# Altium schematic sheet 噪声监测器.SchDoc
size A3; SheetNumber: 0; SheetTotal: 0
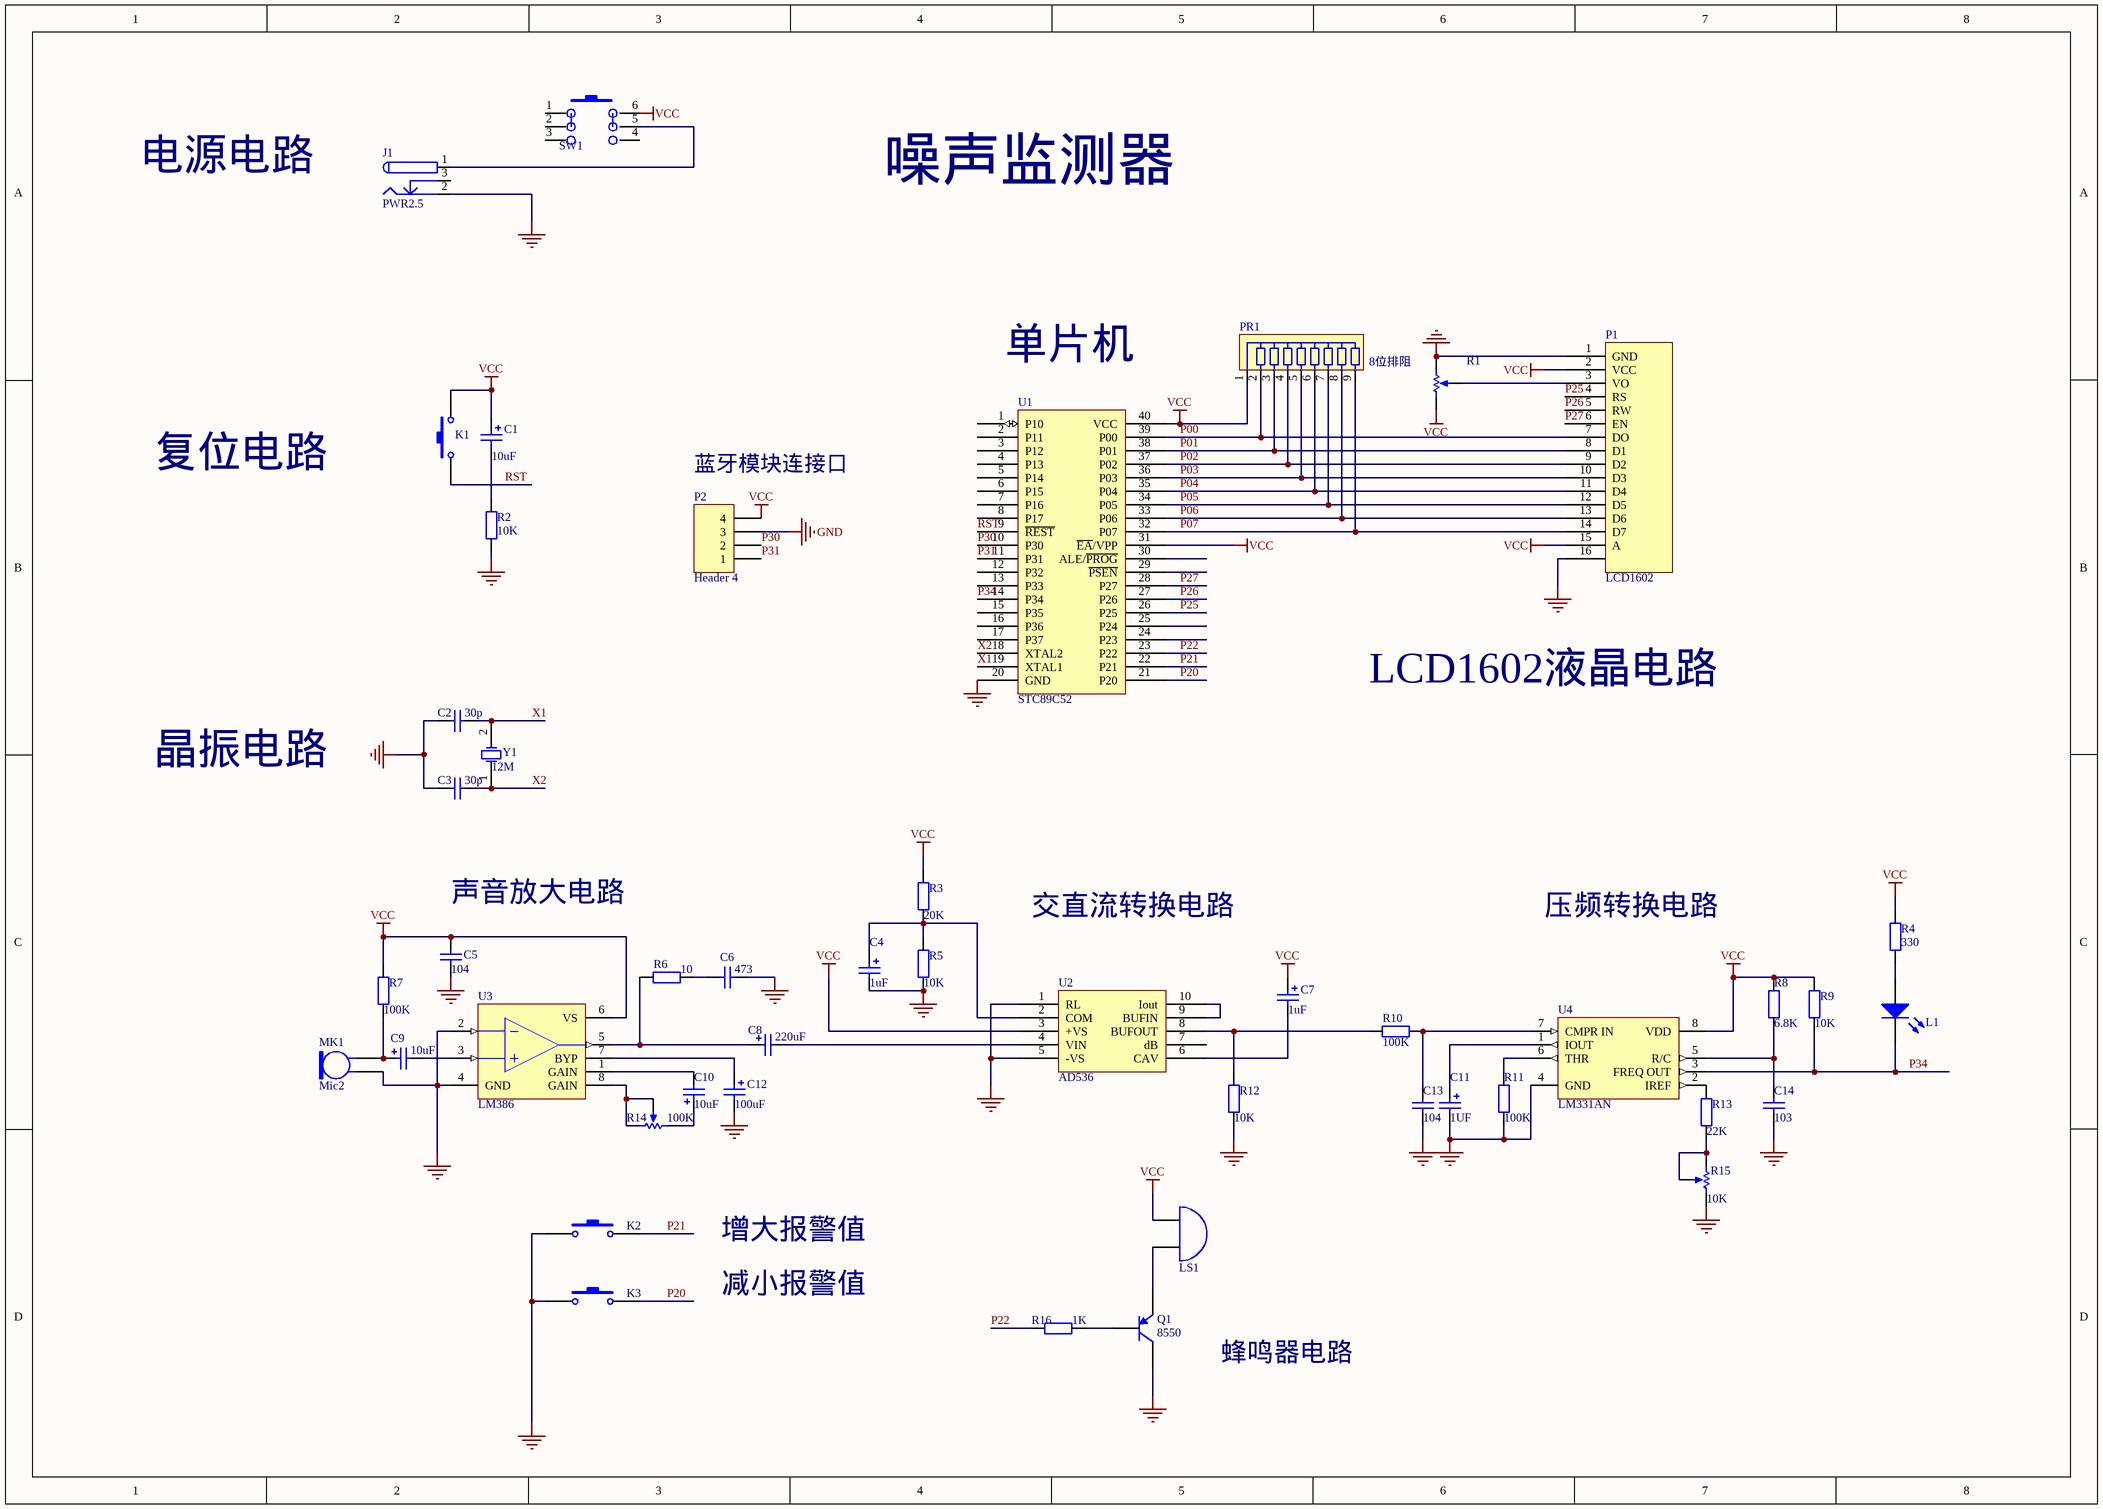
[diagram p0: 噪声监测器.SchDoc]

## Parts
C1  10uF  [CAP2]
C2  30p  [CAPNORM]
C3  30p  [CAPNORM]
C4  1uF  [CAP3]
C5  104  [CAPNORM]
C6  473  [CAPNORM]
C7  1uF  [CAP3]
C8  220uF  [CAP4]
C9  10uF  [CAP2]
C10  10uF  [CAP2]
C11  1UF  [CAP2]
C12  100uF  [CAP3]
C13  104  [CAPNORM]
C14  103  [CAPNORM]
J1  PWR2.5  [PWR5V]
K1  SW-AJ  [KaiGuan]  (value not drawn)
K2  SW-AJ  [KaiGuan]  (value not drawn)
K3  SW-AJ  [KaiGuan]  (value not drawn)
L1  LED  [LED]  (value not drawn)
LS1  Bell  [FengMing]  (value not drawn)
MK1  Mic2  [MK1]
P1  LCD1602  [1602]
P2  Header 4  [HT396K-4]
PR1  8位排阻  [HDR1X9]
Q1  8550  [SANJIGUAN]
R1  (no value)  [DIANWEIQI]
R2  10K  [AXIAL-0.3]
R3  20K  [AXIAL-0.3]
R4  330  [AXIAL-0.3]
R5  10K  [AXIAL-0.3]
R6  10  [AXIAL-0.3]
R7  100K  [AXIAL-0.3]
R8  6.8K  [AXIAL-0.3]
R9  10K  [AXIAL-0.3]
R10  100K  [AXIAL-0.3]
R11  100K  [AXIAL-0.3]
R12  10K  [AXIAL-0.3]
R13  22K  [AXIAL-0.3]
R14  100K  [Bianzuqi]
R15  10K  [Bianzuqi]
R16  1K  [AXIAL-0.3]
SW1  SW-6P  [SW-6P]  (value not drawn)
U1  STC89C52  [52DANPIANJi]
U2  AD536  [AD536]
U3  LM386  [LM386]
U4  LM331AN  [LM331AN]
Y1  12M  [JINGZHEN]

## Nets
GND: C2.1 C3.1 C4.2 C5.1 C6.1 C11.2 C12.2 C13.1 C14.1 J1.2 K2.1 K3.1 MK1.2 P1.1(GND) P1.16(K) P2.3 Q1.3(C) R1.3(TAP) R2.1 R5.2 R11.1 R12.2 R15.3(TAP) U1.20(GND) U2.1(RL) U2.5(-VS) U3.2(IN-) U3.4(GND) U4.4(GND)
VCC: C1.1 C5.2 C7.1 K1.2 LS1.1(A) P1.2(VCC) P1.15(A) P2.4 PR1.1 R1.1(TOP) R3.1 R4.1 R7.2 R8.1 R9.2 SW1.6 U1.31(~{EA}/VPP) U1.40(VCC) U2.3(+VS) U3.6(VS) U4.8(VDD)
P00: P1.7(DO) PR1.2 U1.39(P00)
P01: P1.8(D1) PR1.3 U1.38(P01)
P02: P1.9(D2) PR1.4 U1.37(P02)
P03: P1.10(D3) PR1.5 U1.36(P03)
P04: P1.11(D4) PR1.6 U1.35(P04)
P05: P1.12(D5) PR1.7 U1.34(P05)
P06: P1.13(D6) PR1.8 U1.33(P06)
P07: P1.14(D7) PR1.9 U1.32(P07)
P20: K3.2 U1.21(P20)
P21: K2.2 U1.22(P21)
P22: R16.1 U1.23(P22)
P25: P1.4(RS) U1.26(P25)
P26: P1.5(RW) U1.27(P26)
P27: P1.6(EN) U1.28(P27)
P30: P2.2 U1.10(P30)
P31: P2.1 U1.11(P31)
P34: L1.2(K) R9.1 U1.14(P34) U4.3(FREQ_OUT)
RST: K1.1 U1.9(~{REST})
X1: C2.2 U1.19(XTAL1) Y1.2(OSC2)
X2: C3.2 U1.18(XTAL2) Y1.1(OSC1)
NetC1_2: C1.2 R2.2
NetC4_1: C4.1 R3.2 R5.1 U2.2(COM)
NetC6_2: C6.2 R6.1
NetC7_2: C7.2 U2.6(CAV)
NetC8_1: C8.1 R6.2 U3.5(OUT)
NetC8_2: C8.2 U2.4(VIN)
NetC9_1: C9.1 MK1.1 R7.1
NetC9_2: C9.2 U3.3(IN+)
NetC10_1: C10.1 R14.1(TOP)
NetC10_2: C10.2 U3.1(GAIN)
NetC11_1: C11.1 U4.1(IOUT)
NetC12_1: C12.1 U3.7(BYP)
NetC13_2: C13.2 R10.2 U4.7(CMPR_IN)
NetC14_2: C14.2 R8.2 U4.5(R/C)
NetJ1_1: J1.1 SW1.5
NetL1_1: L1.1(A) R4.2
NetLS1_2: LS1.2(B) Q1.1(E)
NetP1_3: P1.3(VO) R1.2(BOT)
NetQ1_2: Q1.2(B) R16.2
NetR10_1: R10.1 R12.1 U2.8(BUFOUT)
NetR11_2: R11.2 U4.6(THR)
NetR13_1: R13.1 U4.2(IREF)
NetR13_2: R13.2 R15.1(TOP) R15.2(BOT)
NetR14_2: R14.2(BOT) R14.3(TAP) U3.8(GAIN)
NetU2_9: U2.9(BUFIN) U2.10(Iout)

Not connected (* = marked no-connect by the designer): J1 3; SW1 1 2 3 4; U1 1(P10) 2(P11) 3(P12) 4(P13) 5(P14) 6(P15) 7(P16) 8(P17) 12(P32) 13(P33) 15(P35) 16(P36) 17(P37) 24(P23) 25(P24) 29(~{PSEN}) 30(ALE/~{PROG}); U2 7(dB)

## Notes on the sheet
- 电源电路
- 噪声监测器
- 单片机
- 复位电路
- (near P2) 蓝牙模块连接口
- LCD1602液晶电路
- 晶振电路
- (near C5) 声音放大电路
- 交直流转换电路
- 压频转换电路
- 增大报警值
- 减小报警值
- 蜂鸣器电路

## Library data of the parts
C1 C4 C7-C12 = C+
C2 C3 = CAP: Value: 33p
C5 C6 C13 C14 = CAP
J1 = PWR2.5: Low Voltage Power Supply Connector; Published: 17-Dec-2003; DatasheetDocument: 09-May-2002; Publisher: Altium Limited; ComponentLink1Description: Manufacturer Link; ComponentLink1URL: http://domino.kycon.com/internet/Products.html
LS1 = Bell: Electrical Bell; Manufacturer: Generic Components; Published: 1999
MK1 = Mic2: Microphone; Published: 24-Mar-1999; LatestRevisionDate: 17-Jul-2002; LatestRevisionNote: Re-released for DXP Platform.; PackageReference: PIN2; Publisher: Altium Limited
P2 = Header 4: Header, 4-Pin; LatestRevisionDate: 17-Jul-2002; LatestRevisionNote: Re-released for DXP Platform.; Publisher: Altium Limited
Q1 = 2N3906: PNP General Purpose Amplifier; Published: 8-Jun-2000; LatestRevisionDate: 15-Jan-2003; LatestRevisionNote: PCB Footprint 'BCY-W3/D4.7' replaced; DatasheetVersion: 1997; PackageVersion: Sep-1998; PackageReference: TO-92A; Publisher: Altium Limited; PackageDescription: TO, Flat Index; 3 In-Line, Axial Leads; Body Dia. 4.5mm; Leads 0.51 x 0.48 mm (max); ComponentLink1Description: Manufacturer Link; ComponentLink1URL: http://www.fairchildsemi.com/; ComponentLink2Description: Datasheet; ComponentLink2URL: http://www.fairchildsemi.com/ds/2N%2F2N3906.pdf
R1 = RPot: Potentiometer; Sim Note: Enter the Resistance value and the set point into parameter fields.; Set Position: 0.5; Value: 10K; Published: 8-Jun-2000; LatestRevisionDate: 17-Jul-2002; LatestRevisionNote: Re-released for DXP Platform.; PackageReference: VR5; Publisher: Altium Limited; PackageDescription: Variable Resistor, Thru-Hole; 3 Leads
R2 R16 = Res2: Resistor; Published: 8-Jun-2000; LatestRevisionDate: 17-Jul-2002; LatestRevisionNote: Re-released for DXP Platform.; PackageReference: AXIAL-0.4; Publisher: Altium Limited
  R2: Value: 10K
  R16: Value: 1K
R3 R5-R7 R12 = RES0.4
R4 = Res2: Resistor; Value: 1K; Published: 8-Jun-2000; LatestRevisionDate: 17-Jul-2002; LatestRevisionNote: Re-released for DXP Platform.; PackageReference: AXIAL-0.4; Publisher: Altium Limited
R8-R11 R13 = 电阻
R14 R15 = RPot: Potentiometer; Sim Note: Enter the Resistance value and the set point into parameter fields.; Set Position: 0.5; Published: 8-Jun-2000; LatestRevisionDate: 17-Jul-2002; LatestRevisionNote: Re-released for DXP Platform.; PackageReference: VR5; Publisher: Altium Limited; PackageDescription: Variable Resistor, Thru-Hole; 3 Leads
  R14: Value: 100K
  R15: Value: 10K
U1 = AT89S52_1
U2 = AD536A
U3 = LM386M-1: Low-Voltage Audio Power Amplifier; Published: 15-Apr-2002; LatestRevisionDate: 13-Apr-2006; LatestRevisionNote: IPC-7351 Footprint Added.; DatasheetVersion: Sep-1997; PackageVersion: Sep-1997; PackageReference: M08A; Publisher: Altium Limited; PackageDescription: 8-Pin Small Outline Integrated Circuit 1.27 mm Pitch; Code_JEDEC: MS-012-AA; Code_IPC: SOIC127P600-8; ComponentLink1Description: Manufacturer Link; ComponentLink1URL: http://www.national.com/; ComponentLink2Description: Datasheet; ComponentLink2URL: http://www.national.com/ds.cgi/LM/LM386.pdf; ComponentLink3Description: URL Link1; ComponentLink3URL: http://www.national.com/pf/LM/LM386.html
U4 = LM331AN: Precision Voltage-to-Frequency Converter; Note: Metal case is connected to pin 4 (Ground); Note: Pin2 can be used as a voltage reference for other components, but care must taken to ensure that current is not taken from it which could reduce the accuracy of the converter; Published: 15-Apr-2002; LatestRevisionDate: 06-Jun-2005; LatestRevisionNote: Stylized 3D Model Added.; DatasheetVersion: Jun-1999; PackageVersion: Sep-1997; PackageReference: N08E; Publisher: Altium Limited; PackageDescription: DIP; 8 Leads; Row Spacing 7.62 mm; Pitch 2.54 mm; ComponentLink1Description: Manufacturer Link; ComponentLink1URL: http://www.national.com/; ComponentLink2Description: Datasheet; ComponentLink2URL: http://www.national.com/ds.cgi/LM/LM231.pdf; ComponentLink3Description: URL Link1; ComponentLink3URL: http://www.national.com/pf/LM/LM331.html
Y1 = XTAL: Crystal Oscillator; Manufacturer: Generic Components; Published: 08/06/2000; Publisher: Altium Hobart Technology Centre; Class: Oscillator; SubClass: Crystal Oscillator